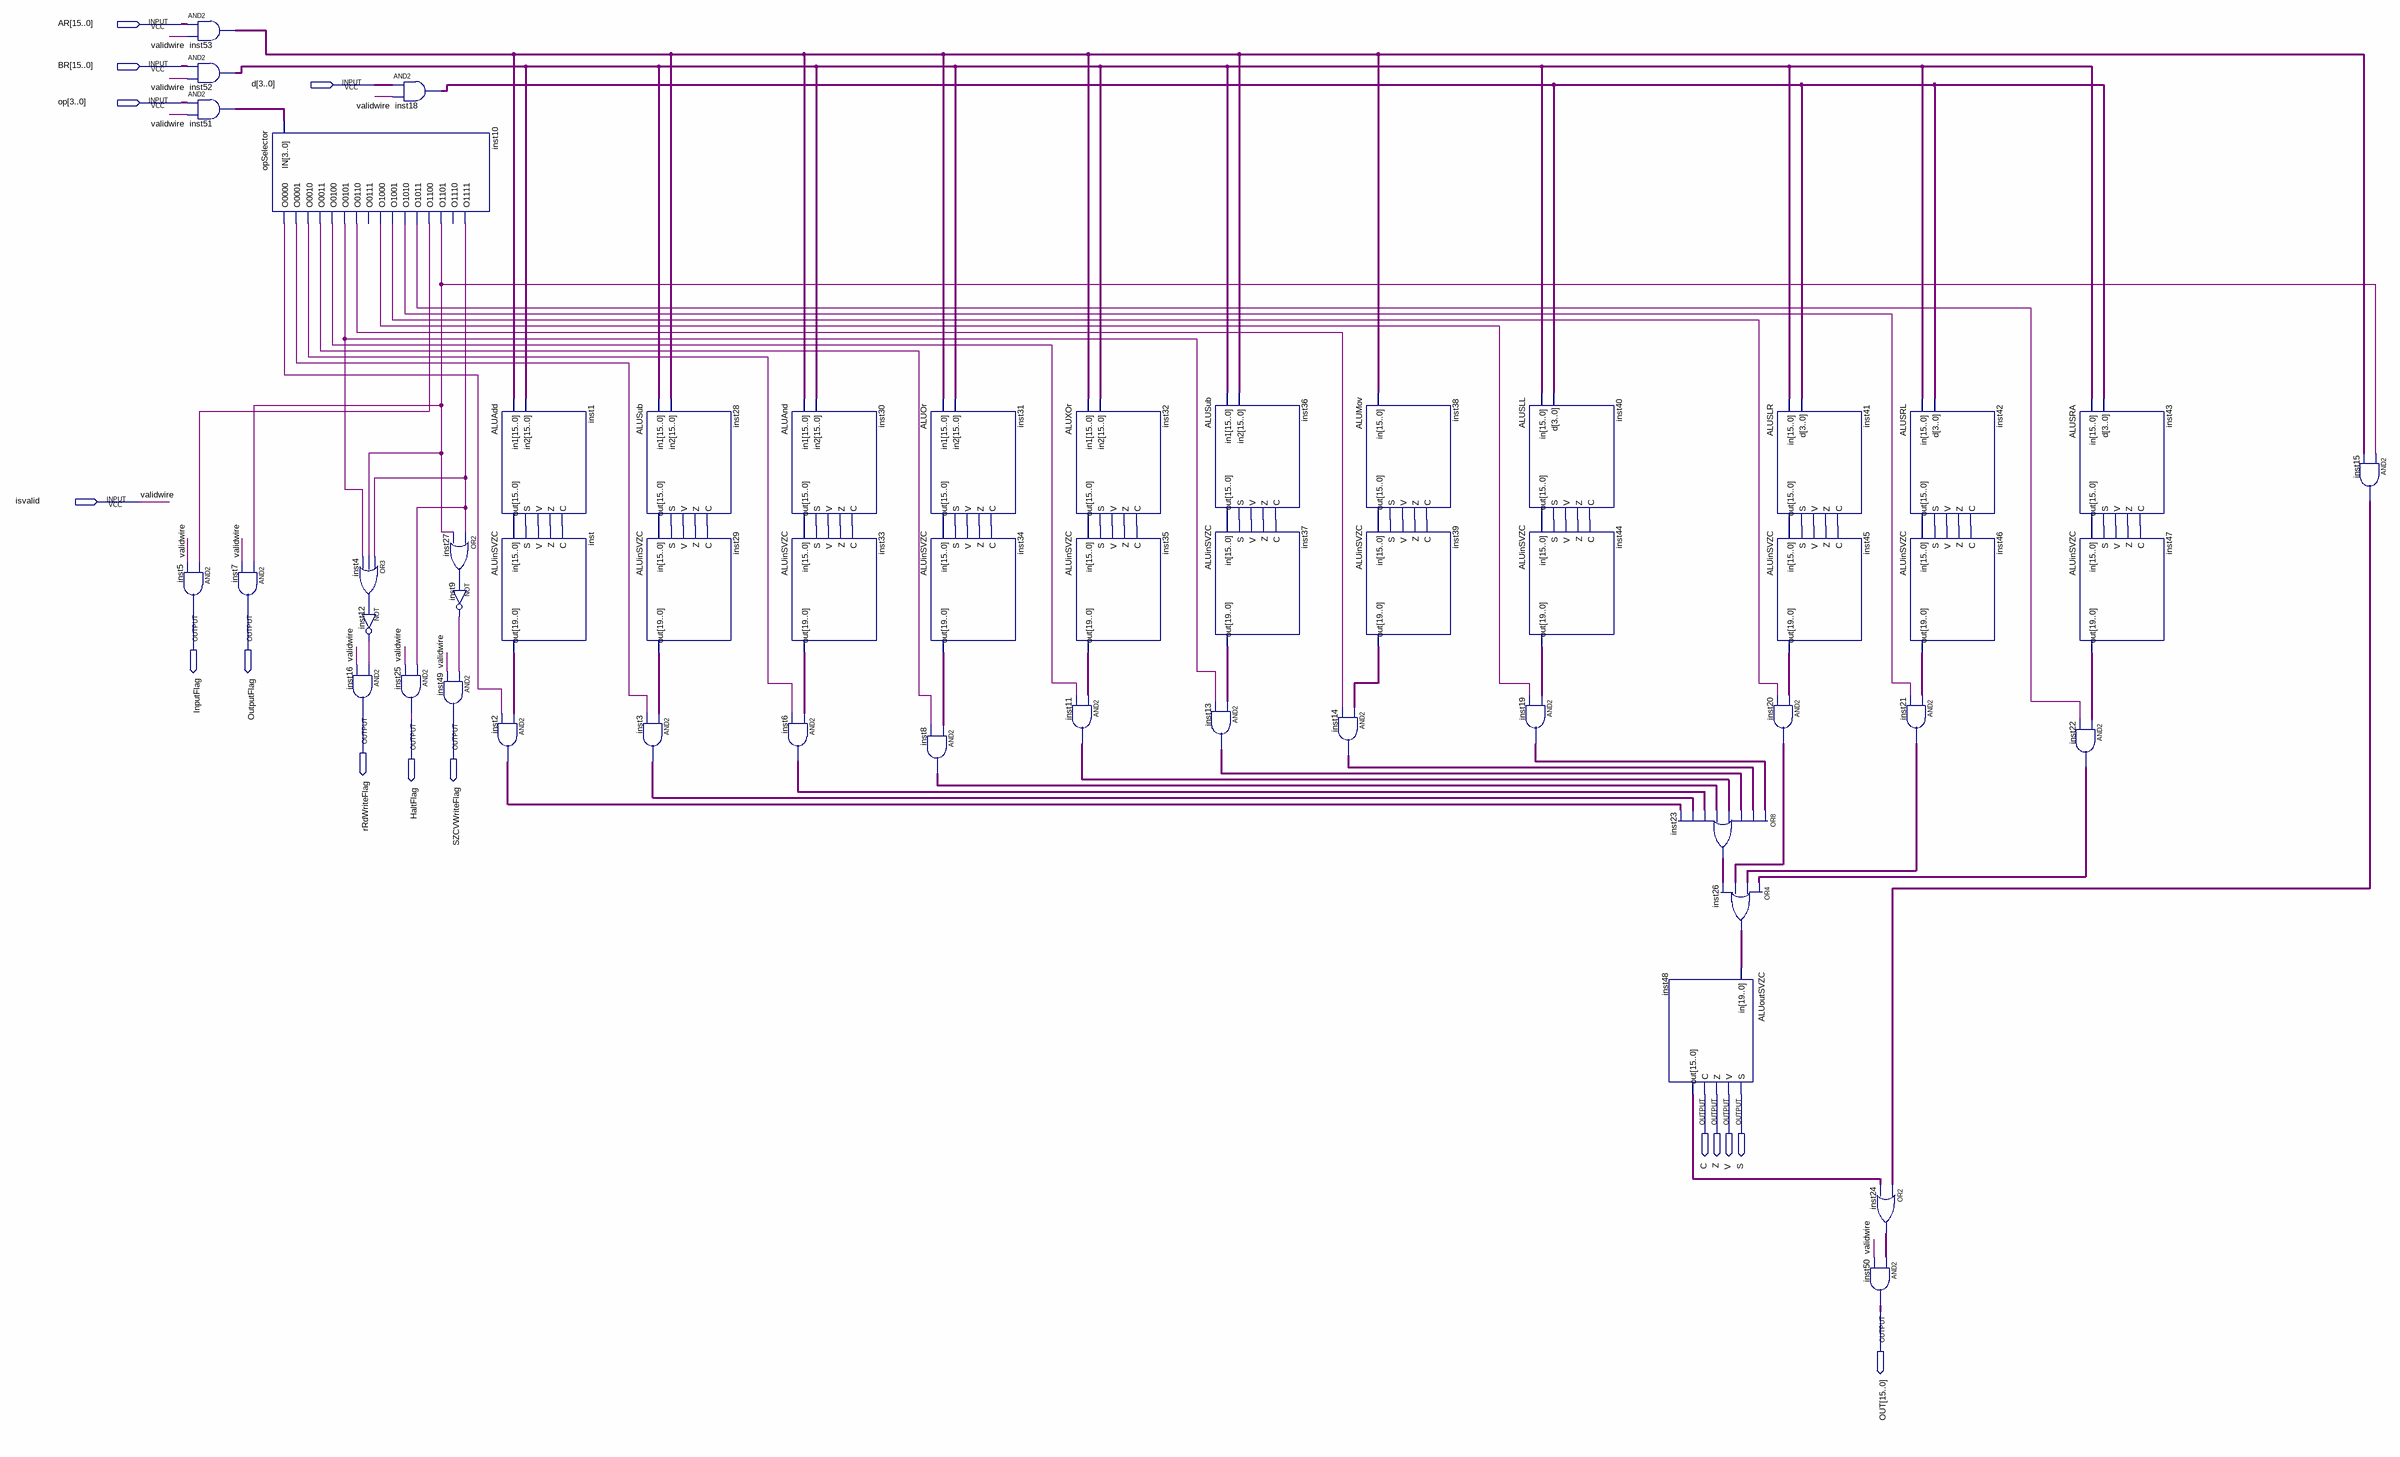
[diagram p0: schematic sheet]
// Quartus schematic ALU.bdf as structural Verilog: 53 symbols, 15 pins
module ALU (
  input  [15:0] AR,
  input  [15:0] BR,
  input  [3:0] d,
  input  [3:0] op,
  input  isvalid,
  output InputFlag,
  output OutputFlag,
  output rRdWriteFlag,
  output HaltFlag,
  output SZCVWriteFlag,
  output C,
  output Z,
  output V,
  output S,
  output [15:0] OUT
);

  wire inst1_c, inst1_s, inst1_v, inst1_z, inst4_out, inst9_out, inst10_o0000, inst10_o0001, inst10_o0010,
       inst10_o0011, inst10_o0100, inst10_o0101, inst10_o0110, inst10_o1000, inst10_o1001, inst10_o1010,
       inst10_o1011, inst10_o1100, inst10_o1101, inst10_o1111, inst12_out, inst27_out, inst28_c, inst28_s,
       inst28_v, inst28_z, inst30_c, inst30_s, inst30_v, inst30_z, inst31_c, inst31_s, inst31_v, inst31_z,
       inst32_c, inst32_s, inst32_v, inst32_z, inst36_c, inst36_s, inst36_v, inst36_z, inst38_c, inst38_s,
       inst38_v, inst38_z, inst40_c, inst40_s, inst40_v, inst40_z, inst41_c, inst41_s, inst41_v, inst41_z,
       inst42_c, inst42_s, inst42_v, inst42_z, inst43_c, inst43_s, inst43_v, inst43_z;
  wire [3:0] inst18_out, inst51_out;
  wire [15:0] inst1_out, inst15_out, inst24_out, inst28_out, inst30_out, inst31_out, inst32_out, inst36_out,
       inst38_out, inst40_out, inst41_out, inst42_out, inst43_out, inst48_out, inst52_out, inst53_out;
  wire [19:0] inst2_out, inst3_out, inst6_out, inst8_out, inst11_out, inst13_out, inst14_out, inst19_out,
       inst20_out, inst21_out, inst22_out, inst23_out, inst26_out, inst29_out, inst33_out, inst34_out,
       inst35_out, inst37_out, inst39_out, inst44_out, inst45_out, inst46_out, inst47_out, inst_out;

  assign inst53_out = AR & {16{isvalid}};  // AND2 inst53, 16 bits wide
  assign inst52_out = BR & {16{isvalid}};  // AND2 inst52, 16 bits wide
  assign inst51_out = op & {4{isvalid}};  // AND2 inst51, 4 bits wide
  and inst5 (InputFlag, inst10_o1100, isvalid);
  and inst7 (OutputFlag, inst10_o1101, isvalid);
  opSelector inst10 (
    .IN(inst51_out), .O0000(inst10_o0000), .O0001(inst10_o0001), .O0010(inst10_o0010), .O0011(inst10_o0011),
    .O0100(inst10_o0100), .O0101(inst10_o0101), .O0110(inst10_o0110), .O1000(inst10_o1000),
    .O1001(inst10_o1001), .O1010(inst10_o1010), .O1011(inst10_o1011), .O1100(inst10_o1100),
    .O1101(inst10_o1101), .O1111(inst10_o1111));  // open: O0111, O1110
  and inst16 (rRdWriteFlag, inst12_out, isvalid);
  assign inst18_out = d & {4{isvalid}};  // AND2 inst18, 4 bits wide
  or inst4 (inst4_out, inst10_o1111, inst10_o1101, inst10_o0101);
  not inst12 (inst12_out, inst4_out);
  and inst25 (HaltFlag, inst10_o1111, isvalid);
  or inst27 (inst27_out, inst10_o1111, inst10_o1101);
  and inst49 (SZCVWriteFlag, inst9_out, isvalid);
  ALUAdd inst1 (
    .in1(inst53_out), .in2(inst52_out), .out(inst1_out), .S(inst1_s), .V(inst1_v), .Z(inst1_z), .C(inst1_c));
  ALUinSVZC inst (.in(inst1_out), .S(inst1_s), .V(inst1_v), .Z(inst1_z), .C(inst1_c), .out(inst_out));
  not inst9 (inst9_out, inst27_out);
  assign inst2_out = inst_out & {20{inst10_o0000}};  // AND2 inst2, 20 bits wide
  ALUSub inst28 (
    .in1(inst52_out), .in2(inst53_out), .out(inst28_out), .S(inst28_s), .V(inst28_v), .Z(inst28_z),
    .C(inst28_c));
  ALUinSVZC inst29 (.in(inst28_out), .S(inst28_s), .V(inst28_v), .Z(inst28_z), .C(inst28_c), .out(inst29_out));
  assign inst3_out = inst29_out & {20{inst10_o0001}};  // AND2 inst3, 20 bits wide
  ALUAnd inst30 (
    .in1(inst53_out), .in2(inst52_out), .out(inst30_out), .S(inst30_s), .V(inst30_v), .Z(inst30_z),
    .C(inst30_c));
  ALUinSVZC inst33 (.in(inst30_out), .S(inst30_s), .V(inst30_v), .Z(inst30_z), .C(inst30_c), .out(inst33_out));
  assign inst6_out = inst33_out & {20{inst10_o0010}};  // AND2 inst6, 20 bits wide
  ALUOr inst31 (
    .in1(inst53_out), .in2(inst52_out), .out(inst31_out), .S(inst31_s), .V(inst31_v), .Z(inst31_z),
    .C(inst31_c));
  ALUinSVZC inst34 (.in(inst31_out), .S(inst31_s), .V(inst31_v), .Z(inst31_z), .C(inst31_c), .out(inst34_out));
  assign inst8_out = inst34_out & {20{inst10_o0011}};  // AND2 inst8, 20 bits wide
  ALUXOr inst32 (
    .in1(inst53_out), .in2(inst52_out), .out(inst32_out), .S(inst32_s), .V(inst32_v), .Z(inst32_z),
    .C(inst32_c));
  ALUinSVZC inst35 (.in(inst32_out), .S(inst32_s), .V(inst32_v), .Z(inst32_z), .C(inst32_c), .out(inst35_out));
  assign inst11_out = inst35_out & {20{inst10_o0100}};  // AND2 inst11, 20 bits wide
  ALUSub inst36 (
    .in1(inst52_out), .in2(inst53_out), .out(inst36_out), .S(inst36_s), .V(inst36_v), .Z(inst36_z),
    .C(inst36_c));
  ALUinSVZC inst37 (.in(inst36_out), .S(inst36_s), .V(inst36_v), .Z(inst36_z), .C(inst36_c), .out(inst37_out));
  assign inst13_out = inst37_out & {20{inst10_o0101}};  // AND2 inst13, 20 bits wide
  ALUMov inst38 (.in(inst53_out), .out(inst38_out), .S(inst38_s), .V(inst38_v), .Z(inst38_z), .C(inst38_c));
  ALUinSVZC inst39 (.in(inst38_out), .S(inst38_s), .V(inst38_v), .Z(inst38_z), .C(inst38_c), .out(inst39_out));
  assign inst14_out = inst39_out & {20{inst10_o0110}};  // AND2 inst14, 20 bits wide
  ALUSLL inst40 (
    .in(inst52_out), .d(inst18_out), .out(inst40_out), .S(inst40_s), .V(inst40_v), .Z(inst40_z), .C(inst40_c));
  ALUinSVZC inst44 (.in(inst40_out), .S(inst40_s), .V(inst40_v), .Z(inst40_z), .C(inst40_c), .out(inst44_out));
  assign inst19_out = inst44_out & {20{inst10_o1000}};  // AND2 inst19, 20 bits wide
  assign inst23_out = inst19_out | inst14_out | inst13_out | inst11_out | inst8_out | inst6_out | inst3_out | inst2_out;  // OR8 inst23, 20 bits wide
  ALUoutSVZC inst48 (.in(inst26_out), .S(S), .V(V), .Z(Z), .C(C), .out(inst48_out));
  assign inst26_out = inst22_out | inst21_out | inst20_out | inst23_out;  // OR4 inst26, 20 bits wide
  ALUSLR inst41 (
    .in(inst52_out), .d(inst18_out), .out(inst41_out), .S(inst41_s), .V(inst41_v), .Z(inst41_z), .C(inst41_c));
  ALUinSVZC inst45 (.in(inst41_out), .S(inst41_s), .V(inst41_v), .Z(inst41_z), .C(inst41_c), .out(inst45_out));
  assign inst20_out = inst45_out & {20{inst10_o1001}};  // AND2 inst20, 20 bits wide
  assign inst24_out = inst15_out | inst48_out;  // OR2 inst24, 16 bits wide
  assign OUT = inst24_out & {16{isvalid}};  // AND2 inst50, 16 bits wide
  ALUSRL inst42 (
    .in(inst52_out), .d(inst18_out), .out(inst42_out), .S(inst42_s), .V(inst42_v), .Z(inst42_z), .C(inst42_c));
  ALUinSVZC inst46 (.in(inst42_out), .S(inst42_s), .V(inst42_v), .Z(inst42_z), .C(inst42_c), .out(inst46_out));
  assign inst21_out = inst46_out & {20{inst10_o1010}};  // AND2 inst21, 20 bits wide
  ALUSRA inst43 (
    .in(inst52_out), .d(inst18_out), .out(inst43_out), .S(inst43_s), .V(inst43_v), .Z(inst43_z), .C(inst43_c));
  ALUinSVZC inst47 (.in(inst43_out), .S(inst43_s), .V(inst43_v), .Z(inst43_z), .C(inst43_c), .out(inst47_out));
  assign inst22_out = inst47_out & {20{inst10_o1011}};  // AND2 inst22, 20 bits wide
  assign inst15_out = {16{inst10_o1101}} & inst53_out;  // AND2 inst15, 16 bits wide

  // Other names for the same wires on the sheet: validwire = isvalid
endmodule
